# EAGLE design HQspd_board (EAGLE 9.6.2)
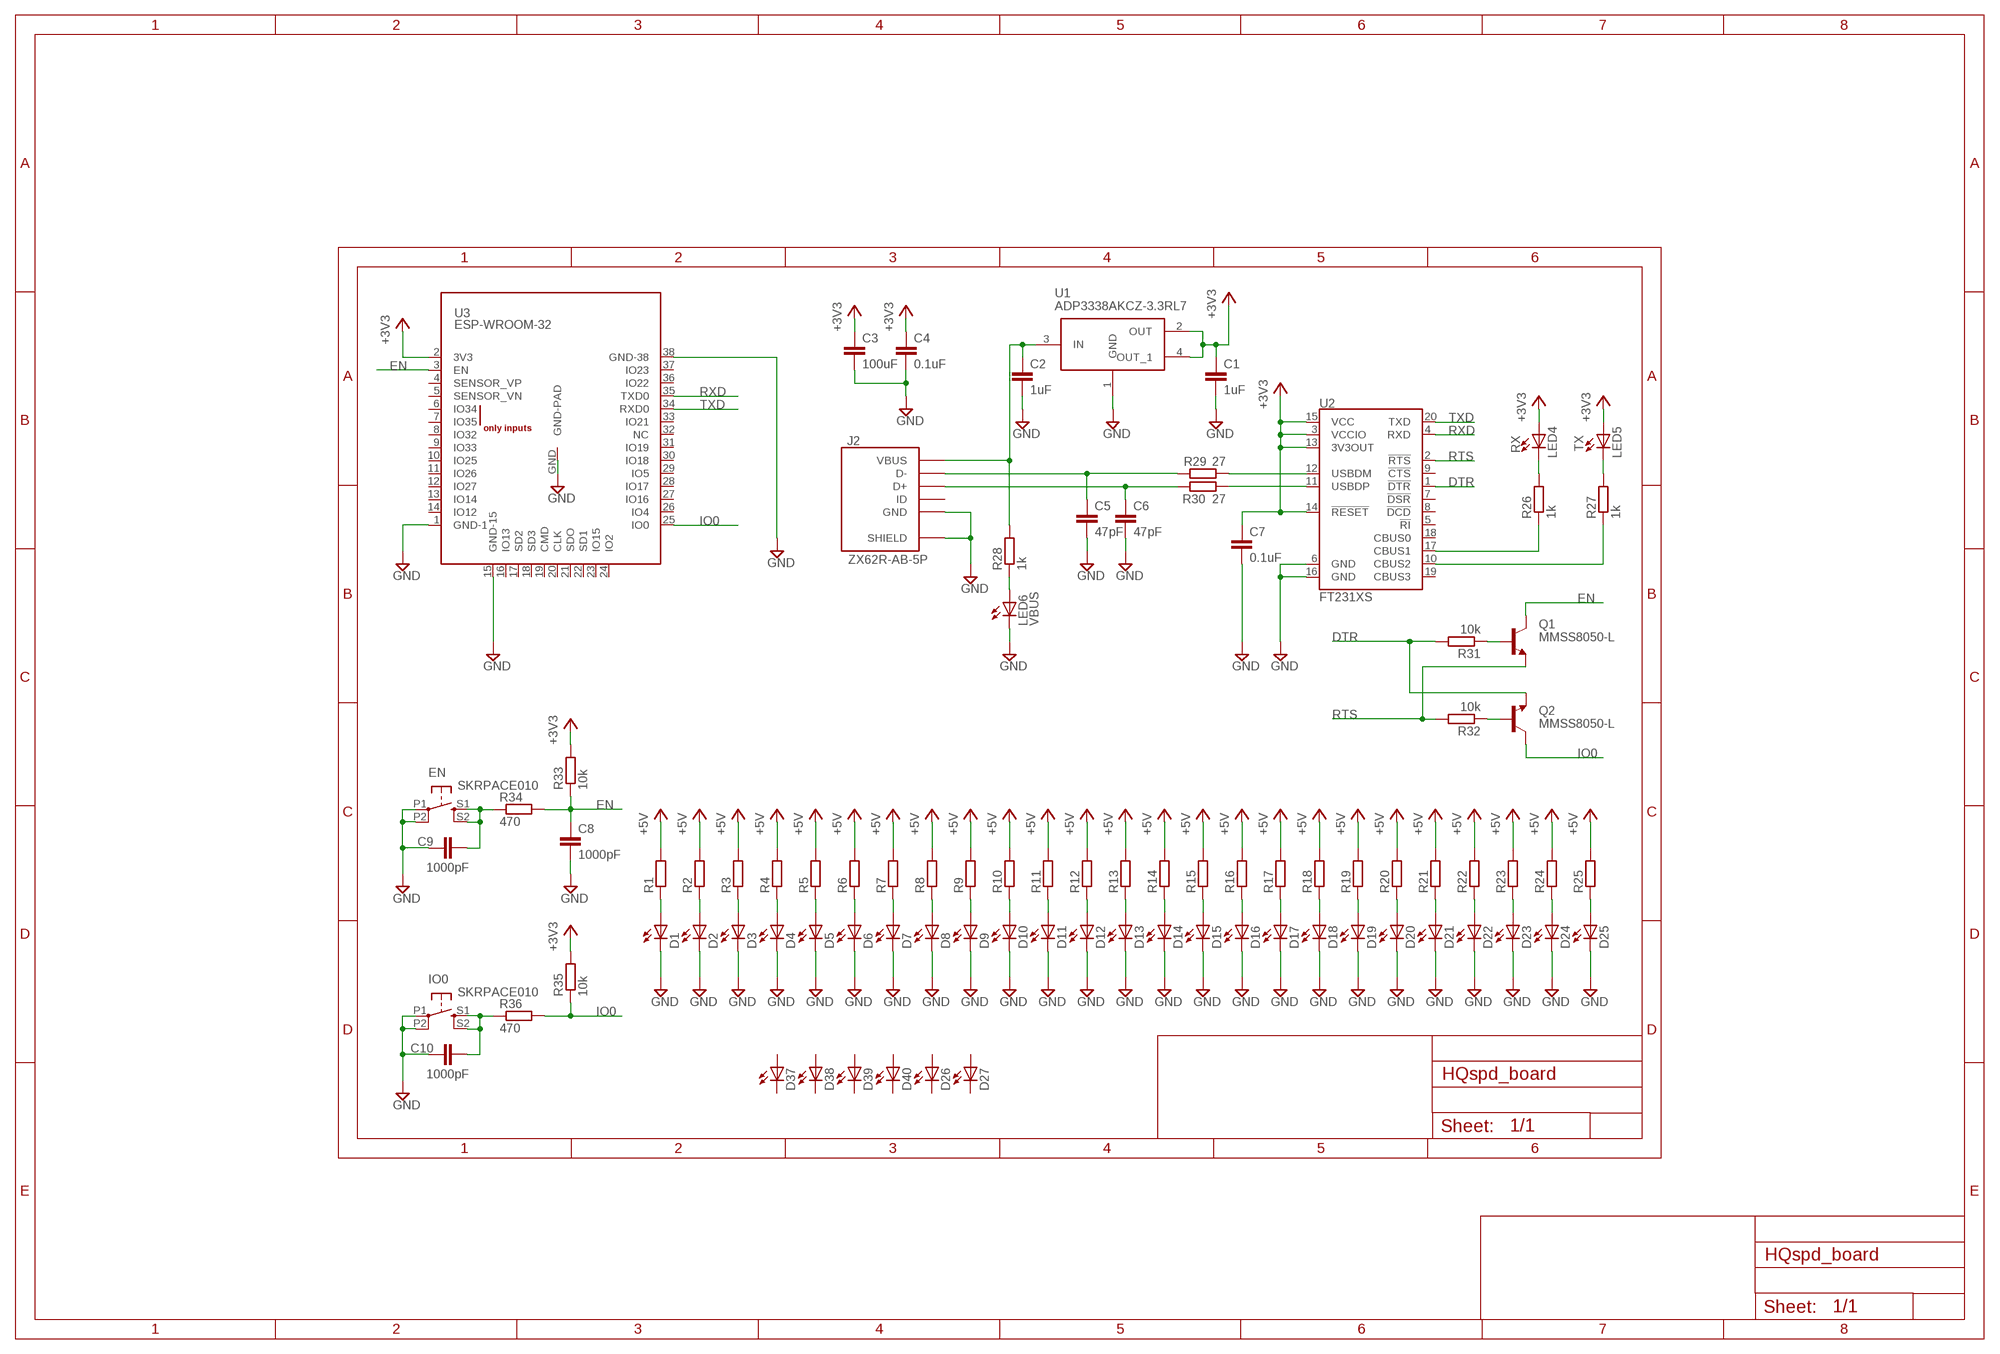
[diagram p0: schematic, sheet 1]

## Parts
C1  1uF  C-EUC0603  [C0603]
C2  1uF  C-EUC0603  [C0603]
C3  100uF  C-EUC1210  [C1210]
C4  0.1uF  C-EUC0603  [C0603]
C5  47pF  C-EUC0603  [C0603]
C6  47pF  C-EUC0603  [C0603]
C7  0.1uF  C-EUC0603  [C0603]
C8  1000pF  C-EUC0603  [C0603]
C9  1000pF  C-EUC0603  [C0603]
C10  1000pF  C-EUC0603  [C0603]
D1  LEDCHIPLED_0603  [CHIPLED_0603]
D2  LEDCHIPLED_0603  [CHIPLED_0603]
D3  LEDCHIPLED_0603  [CHIPLED_0603]
D4  LEDCHIPLED_0603  [CHIPLED_0603]
D5  LEDCHIPLED_0603  [CHIPLED_0603]
D6  LEDCHIPLED_0603  [CHIPLED_0603]
D7  LEDCHIPLED_0603  [CHIPLED_0603]
D8  LEDCHIPLED_0603  [CHIPLED_0603]
D9  LEDCHIPLED_0603  [CHIPLED_0603]
D10  LEDCHIPLED_0603  [CHIPLED_0603]
D11  LEDCHIPLED_0603  [CHIPLED_0603]
D12  LEDCHIPLED_0603  [CHIPLED_0603]
D13  LEDCHIPLED_0603  [CHIPLED_0603]
D14  LEDCHIPLED_0603  [CHIPLED_0603]
D15  LEDCHIPLED_0603  [CHIPLED_0603]
D16  LEDCHIPLED_0603  [CHIPLED_0603]
D17  LEDCHIPLED_0603  [CHIPLED_0603]
D18  LEDCHIPLED_0603  [CHIPLED_0603]
D19  LEDCHIPLED_0603  [CHIPLED_0603]
D20  LEDCHIPLED_0603  [CHIPLED_0603]
D21  LEDCHIPLED_0603  [CHIPLED_0603]
D22  LEDCHIPLED_0603  [CHIPLED_0603]
D23  LEDCHIPLED_0603  [CHIPLED_0603]
D24  LEDCHIPLED_0603  [CHIPLED_0603]
D25  LEDCHIPLED_0603  [CHIPLED_0603]
D26  LED3MM  [LED3MM]
D27  LED3MM  [LED3MM]
D37  LED3MM  [LED3MM]
D38  LED3MM  [LED3MM]
D39  LED3MM  [LED3MM]
D40  LED3MM  [LED3MM]
EN  SKRPACE010  [SKRPACE010]
IO0  SKRPACE010  [SKRPACE010]
J2  ZX62R-AB-5P  [ZX62R-B-5PA]
LED4  RX  LEDCHIPLED_0603  [CHIPLED_0603]
LED5  TX  LEDCHIPLED_0603  [CHIPLED_0603]
LED6  VBUS  LEDCHIPLED_0603  [CHIPLED_0603]
Q1  MMSS8050-L  [SOT23]
Q2  MMSS8050-L  [SOT23]
R1  R-EU_R0603  [R0603]
R2  R-EU_R0603  [R0603]
R3  R-EU_R0603  [R0603]
R4  R-EU_R0603  [R0603]
R5  R-EU_R0603  [R0603]
R6  R-EU_R0603  [R0603]
R7  R-EU_R0603  [R0603]
R8  R-EU_R0603  [R0603]
R9  R-EU_R0603  [R0603]
R10  R-EU_R0603  [R0603]
R11  R-EU_R0603  [R0603]
R12  R-EU_R0603  [R0603]
R13  R-EU_R0603  [R0603]
R14  R-EU_R0603  [R0603]
R15  R-EU_R0603  [R0603]
R16  R-EU_R0603  [R0603]
R17  R-EU_R0603  [R0603]
R18  R-EU_R0603  [R0603]
R19  R-EU_R0603  [R0603]
R20  R-EU_R0603  [R0603]
R21  R-EU_R0603  [R0603]
R22  R-EU_R0603  [R0603]
R23  R-EU_R0603  [R0603]
R24  R-EU_R0603  [R0603]
R25  R-EU_R0603  [R0603]
R26  1k  R-EU_R0603  [R0603]
R27  1k  R-EU_R0603  [R0603]
R28  1k  R-EU_R0603  [R0603]
R29  27  R-EU_R0603  [R0603]
R30  27  R-EU_R0603  [R0603]
R31  10k  R-EU_R0603  [R0603]
R32  10k  R-EU_R0603  [R0603]
R33  10k  R-EU_R0603  [R0603]
R34  470  R-EU_R0603  [R0603]
R35  10k  R-EU_R0603  [R0603]
R36  470  R-EU_R0603  [R0603]
U1  ADP3338AKCZ-3.3RL7  [SOT230P700X180-4N]
U2  FT231XS  [SSOP20_L]
U3  ESP-WROOM-32  [ESP-WROOM-32]

## Nets
+3V3: C1.1 C3.1 C4.1 C7.1 LED4.A LED5.A R33.2 R35.2 U1.2(OUT) U1.4(OUT_1) U2.3(VCCIO) U2.13(3V3OUT) U2.14(!RESET) U2.15(VCC) U3.2(3V3)
+5V: R1.2 R2.2 R3.2 R4.2 R5.2 R6.2 R7.2 R8.2 R9.2 R10.2 R11.2 R12.2 R13.2 R14.2 R15.2 R16.2 R17.2 R18.2 R19.2 R20.2 R21.2 R22.2 R23.2 R24.2 R25.2
+5V1: C2.1 J2.VCC(VBUS) R28.2 U1.3(IN)
D2_N1 [diffrencial pair]: R29.2 U2.12(USBDM)
D2_P1 [diffrencial pair]: R30.2 U2.11(USBDP)
D_N1 [diffrencial pair]: C5.1 J2.D- R29.1
D_P1 [diffrencial pair]: C6.1 J2.D+ R30.1
DTR: Q2.E R31.2 U2.1(!DTR)
EN: C8.1 Q1.C R33.1 R34.2 U3.3(EN)
GND: C1.2 C2.2 C3.2 C4.2 C5.2 C6.2 C7.2 C8.2 C9.1 C10.1 D1.C D2.C D3.C D4.C D5.C D6.C D7.C D8.C D9.C D10.C D11.C D12.C D13.C D14.C D15.C D16.C D17.C D18.C D19.C D20.C D21.C D22.C D23.C D24.C D25.C EN.P1(P) EN.P2(P1) IO0.P1(P) IO0.P2(P1) J2.GND J2.SHIELD@1(SHIELD) J2.SHIELD@2(SHIELD) J2.SHIELD@3(SHIELD) J2.SHIELD@4(SHIELD) LED6.C U1.1(GND) U2.6(GND) U2.16(GND) U3.1(GND-1) U3.15(GND-15) U3.38(GND-38) U3.GND(GND-PAD)
IO0: Q2.C R35.1 R36.2 U3.25(IO0)
N$1: D1.A R1.1
N$2: D11.A R11.1
N$3: D2.A R2.1
N$4: D3.A R3.1
N$5: D4.A R4.1
N$6: D5.A R5.1
N$7: D6.A R6.1
N$8: D7.A R7.1
N$9: D8.A R8.1
N$10: D9.A R9.1
N$11: D10.A R10.1
N$12: D12.A R12.1
N$13: D13.A R13.1
N$14: D14.A R14.1
N$15: D15.A R15.1
N$16: D16.A R16.1
N$17: D17.A R17.1
N$18: D18.A R18.1
N$19: D19.A R19.1
N$20: D20.A R20.1
N$21: D21.A R21.1
N$22: D22.A R22.1
N$23: D23.A R23.1
N$24: D24.A R24.1
N$25: D25.A R25.1
N$26: LED4.C R26.2
N$27: LED5.C R27.2
N$128: C9.2 EN.S1(S) EN.S2(S1) R34.1
N$129: C10.2 IO0.S1(S) IO0.S2(S1) R36.1
N$130: R26.1 U2.17(CBUS1)
N$131: R27.1 U2.10(CBUS2)
N$134: LED6.A R28.1
N$136: Q1.B R31.1
N$137: Q2.B R32.1
RTS: Q1.E R32.2 U2.2(!RTS)
RXD: U2.4(RXD) U3.35(TXD0)
TXD: U2.20(TXD) U3.34(RXD0)
Unconnected: D26.A D26.K(C) D27.A D27.K(C) D37.A D37.K(C) D38.A D38.K(C) D39.A D39.K(C) D40.A D40.K(C) J2.ID U2.5(!RI) U2.7(!DSR) U2.8(!DCD) U2.9(!CTS) U2.18(CBUS0) U2.19(CBUS3) U3.4(SENSOR_VP) U3.5(SENSOR_VN) U3.6(IO34) U3.7(IO35) U3.8(IO32) U3.9(IO33) U3.10(IO25) U3.11(IO26) U3.12(IO27) U3.13(IO14) U3.14(IO12) U3.16(IO13) U3.17(SD2) U3.18(SD3) U3.19(CMD) U3.20(CLK) U3.21(SDO) U3.22(SD1) U3.23(IO15) U3.24(IO2) U3.26(IO4) U3.27(IO16) U3.28(IO17) U3.29(IO5) U3.30(IO18) U3.31(IO19) U3.32(NC) U3.33(IO21) U3.36(IO22) U3.37(IO23)

## Library data of the parts
C1-C10 = taki-library:C-EU: CAPACITOR, European symbol
D1-D27 D37-D40 LED4-LED6 = taki-library:LED: LED OSRAM: - CHIPLED LG R971, LG N971, LY N971, LG Q971, LY Q971, LO R971, LY R971 LH N974, LH R974 LS Q976, LO Q976, LY Q976 LO Q996 - Hyper CHIPLED LW Q18S LB Q993, LB Q99A, LB R99A - SideLED LS A670, LO A670, LY A670, LG A670, LP A670 LB A673, LV A673, LT A673, LW A673 LH A674 LY A675 LS A676, LA A676, LO A676, LY A676, LW A676 LS A679, LY A679, LG A679 - Hyper Micro SIDELED® LS Y876, LA Y876, LO Y876, LY Y876 LT Y87S - SmartLED LW L88C, LW L88S LB L89C, LB L89S, LG L890 LS L89K, LO L89K, LY L89K LS L896, LA L896, LO L896, LY L896 - TOPLED LS T670, LO T670, LY T670, LG T670, LP T670 LSG T670, LSP T670, LSY T670, LOP T670, LYG T670 LG T671, LOG T671, LSG T671 LB T673, LV T673, LT T673, LW T673 LH T674 LS T676, LA T676, LO T676, LY T676, LB T676, LH T676, LSB T676, LW T676 LB T67C, LV T67C, LT T67C, LS T67K, LO T67K, LY T67K, LW E67C LS E67B, LA E67B, LO E67B, LY E67B, LB E67C, LV E67C, LT E67C LW T67C LS T679, LY T679, LG T679 LS T770, LO T770, LY T770, LG T770, LP T770 LB T773, LV T773, LT T773, LW T773 LH T774 LS E675, LA E675, LY E675, LS T675 LS T776, LA T776, LO T776, LY T776, LB T776 LHGB T686 LT T68C, LB T68C - Hyper Mini TOPLED® LB M676 - Mini TOPLED Santana® LG M470 LS M47K, LO M47K, LY M47K Source: http://www.osram.convergy.de LUXEON: - LUMILED® LXK2-PW12-R00, LXK2-PW12-S00, LXK2-PW14-U00, LXK2-PW14-V00 LXK2-PM12-R00, LXK2-PM12-S00, LXK2-PM14-U00 LXK2-PE12-Q00, LXK2-PE12-R00, LXK2-PE12-S00, LXK2-PE14-T00, LXK2-PE14-U00 LXK2-PB12-K00, LXK2-PB12-L00, LXK2-PB12-M00, LXK2-PB14-N00, LXK2-PB14-P00, LXK2-PB14-Q00 LXK2-PR12-L00, LXK2-PR12-M00, LXK2-PR14-Q00, LXK2-PR14-R00 LXK2-PD12-Q00, LXK2-PD12-R00, LXK2-PD12-S00 LXK2-PH12-R00, LXK2-PH12-S00 LXK2-PL12-P00, LXK2-PL12-Q00, LXK2-PL12-R00 Source: www.luxeon.com KINGBRIGHT: KA-3528ASYC Source: www.kingbright.com
EN IO0 = taki-library:SKRPACE010
J2 = taki-library:ZX62
Q1 Q2 = taki-library:MMSS8050: Bipolar (BJT) Transistor NPN 25V 1.5A 100MHz 625mW Surface Mount SOT-23; DIGIKEY_URL: https://www.digikey.jp/product-detail/ja/micro-commercial-co/MMSS8050-L-TP/MMSS8050-L-TPMSCT-ND/2827203; MARUTSU_URL: https://www.marutsu.co.jp/pc/i/15861860/; STORE: MARUTSU; URL: https://www.marutsu.co.jp/pc/i/15861860/
R1-R36 = taki-library:R-EU_: RESISTOR, European symbol
U1 = library:ADP3338AKCZ-3.3RL7: LDO Regulator 3.3V 1.6A Analog Devices ADP3338AKCZ-3.3RL7, LDO Voltage Regulator, 1.6A, 3.3 V 0.8%, 2.7 8 Vin, 4-Pin SOT-223 Source: Datasheet <http://uk.rs-online.com/web/p/products/9126350>; DESCRIPTION: LDO Regulator 3.3V 1.6A Analog Devices ADP3338AKCZ-3.3RL7, LDO Voltage Regulator, 1.6A, 3.3 V 0.8%, 2.7 8 Vin, 4-Pin SOT-223; HEIGHT: 1.8mm; MANUFACTURER_NAME: Analog Devices; MANUFACTURER_PART_NUMBER: ADP3338AKCZ-3.3RL7; RS_PART_NUMBER: 9126350
U2 = taki-library:FT231X: FTDI FT231X Full Speed USB to Full-handshake UART This USB2.0 Full Speed IC offers a compact bridge to full handshake UART interfaces. The device is a UART, capable of operating up to 3MBaud, with low power consumption (8mA). The FT231X includes the complete FT-X series feature set and enables USB to be added into a system design quickly and easily over a UART interface. Datasheet <http://cdn.sparkfun.com/datasheets/Components/General%20IC/DS_FT231X.pdf> SparkFun Products SparkFun RedBoard - Programmed with Arduino <https://www.sparkfun.com/products/12757> (DEV-12757) SparkFun XBee Explorer USB <https://www.sparkfun.com/products/11812> (WRL-11812) SparkFun XBee Explorer Dongle <https://www.sparkfun.com/products/11697> (WRL-11697) SparkFun Blynk Board - ESP8266 <https://www.sparkfun.com/products/13794> (WRL-13794) SparkFun ESP8266 Thing - Dev Board <https://www.sparkfun.com/products/13711> (WRL-13711) SparkFun Block for Intel® Edison - Base <https://www.sparkfun.com/products/13045> (DEV-13045) SparkFun RedStick <https://www.sparkfun.com/products/13741> (DEV-13741) SparkFun Beefy 3 - FTDI Basic Breakout <https://www.sparkfun.com/products/13746> (DEV-13746) SparkFun FT231X Breakout <https://www.sparkfun.com/products/11736> (BOB-11736); PROD_ID: IC-11524
U3 = taki-library:ESP-WROOM-32

## Net classes
2 diffrencial pair: width 0.15 mm, clearance 0.3 mm to class 0, clearance 0.3 mm to class 1, clearance 0.15 mm

## Board
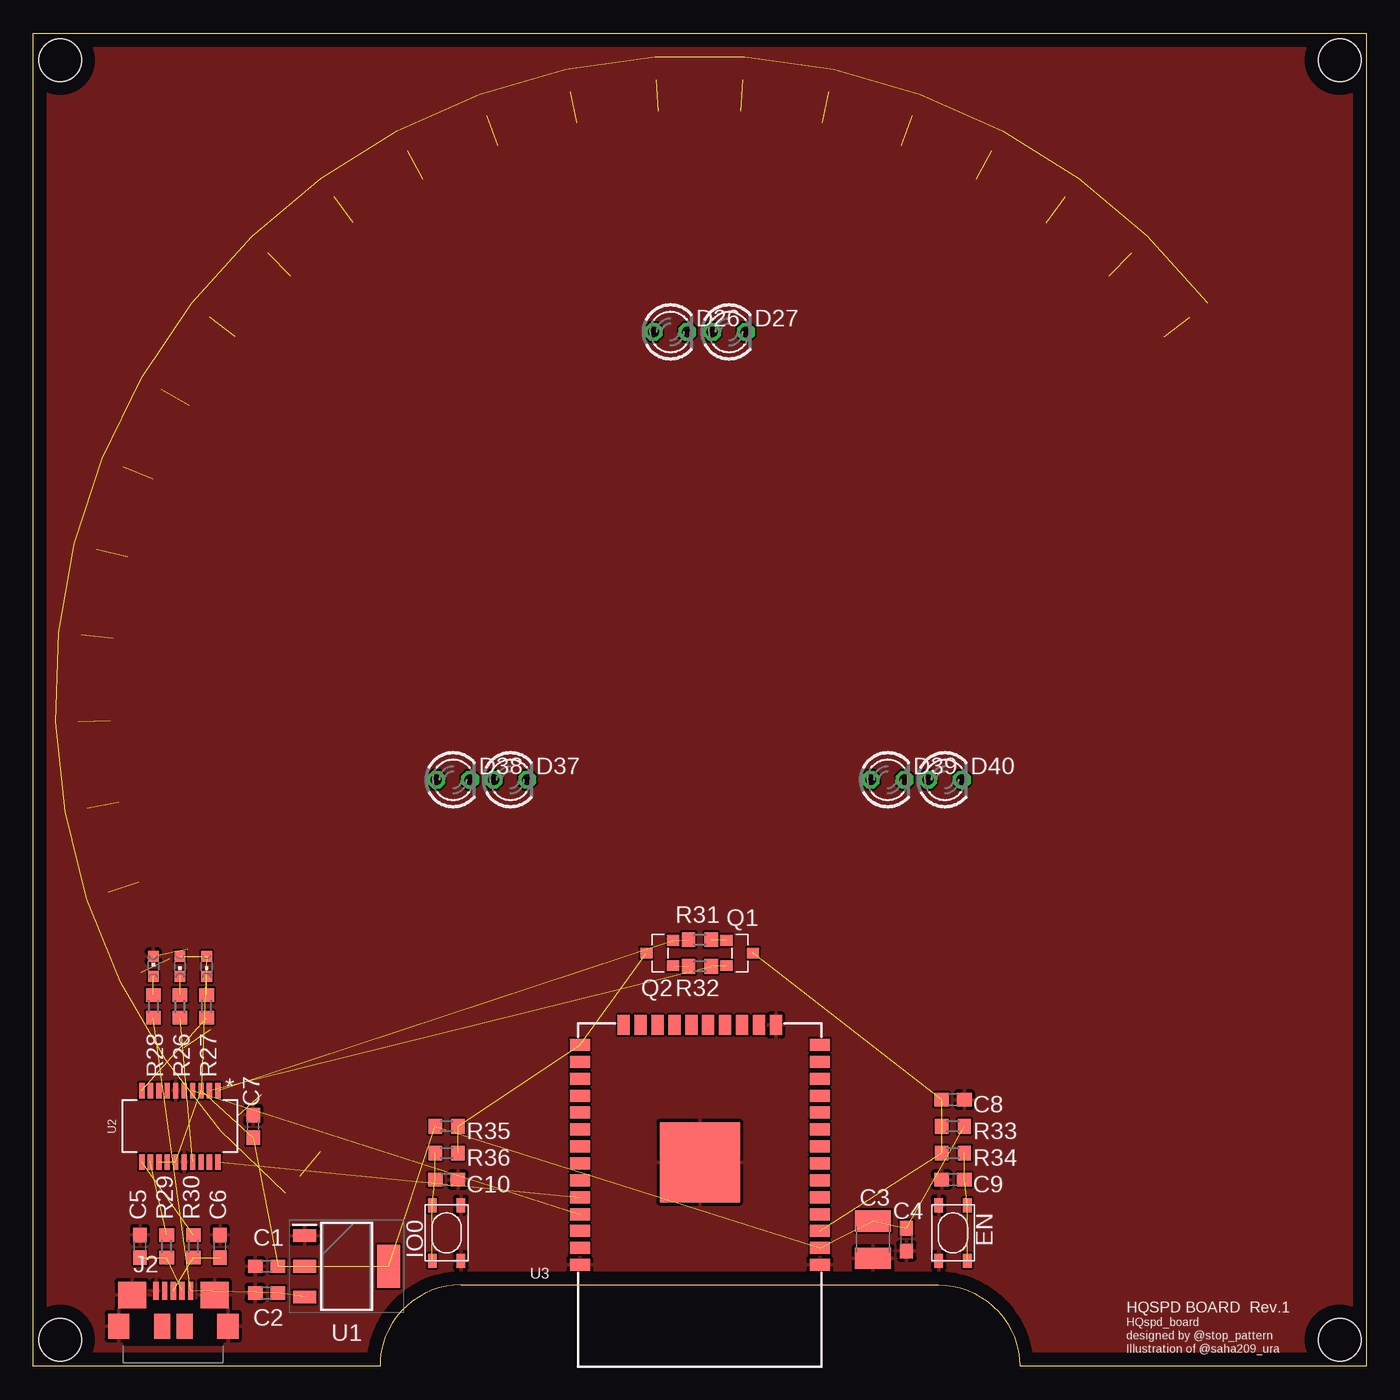
[diagram p1: board, top side]
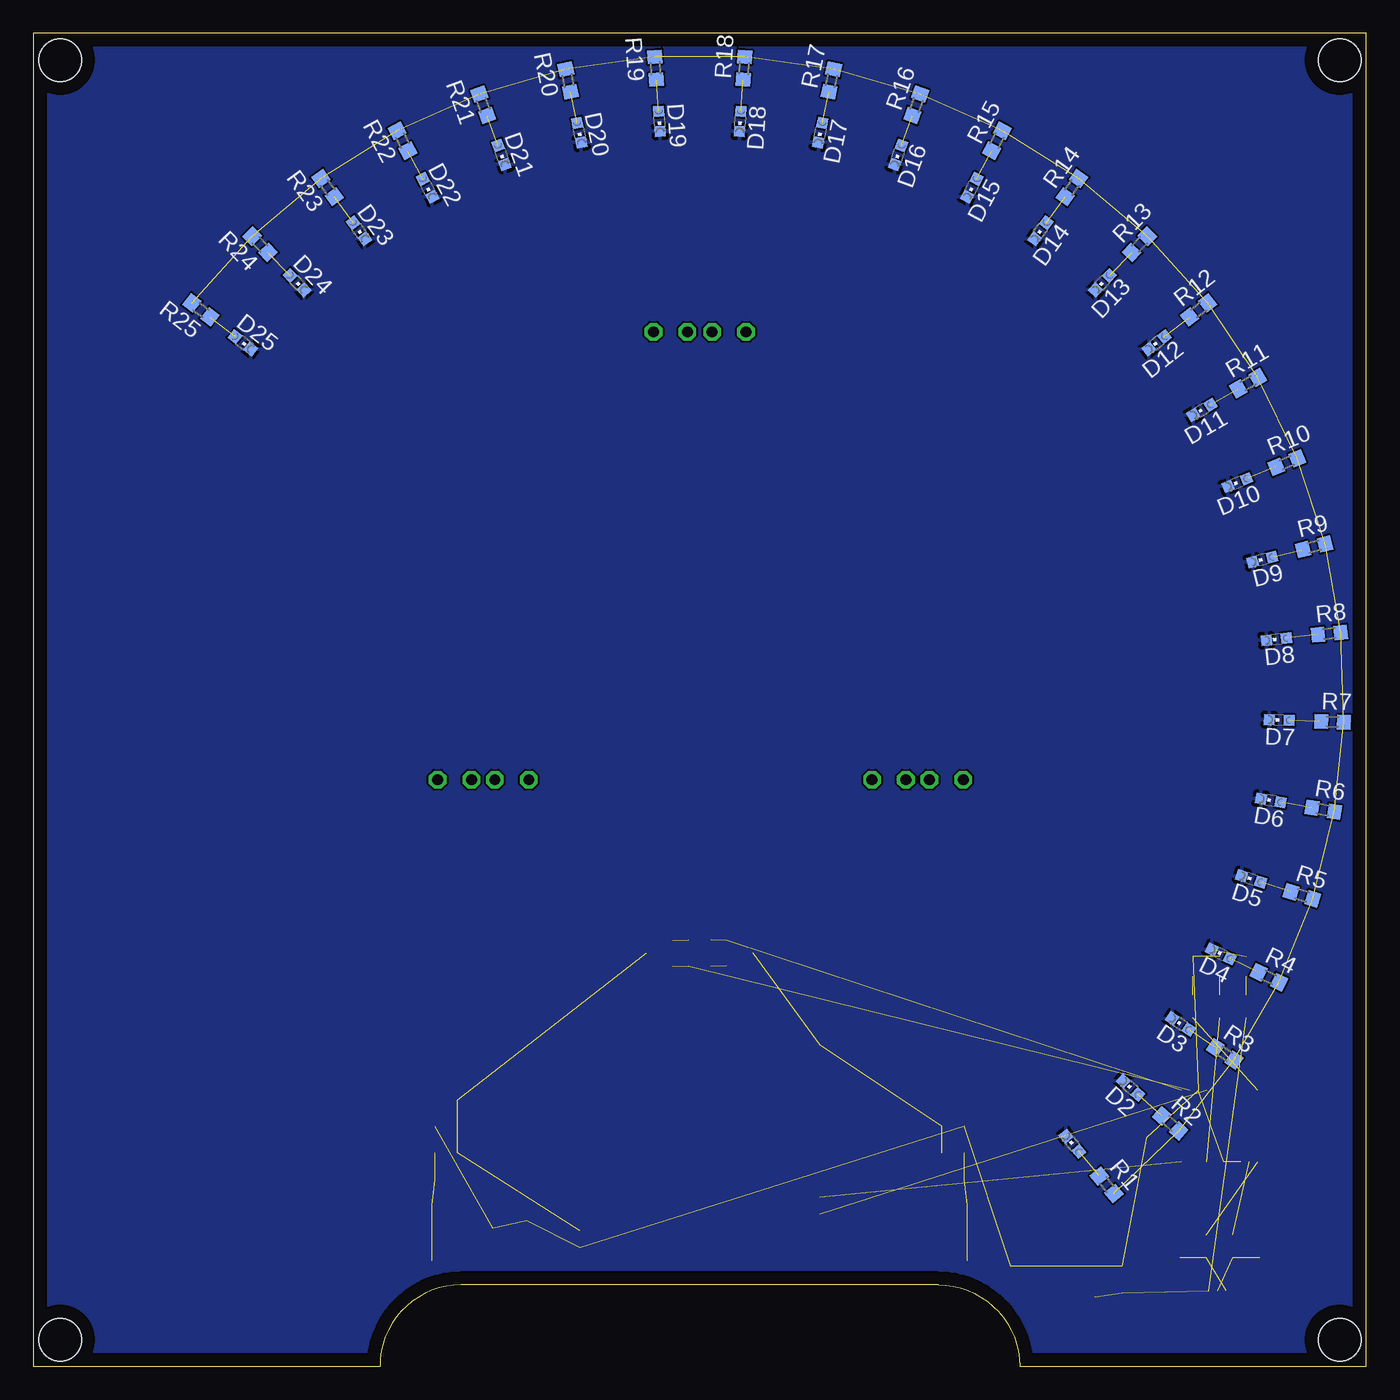
[diagram p2: board, bottom side, seen from below]

Size 100 x 100 mm. Coordinates in mm from the lower left corner, seen from the top.
Outline: 0,0 0,100 100,100 100,0 74,0 arc90 67.9,6.1 32.1,6.1 arc90 26,0 0,0
Copper layers (1*16): Top 0.035mm / dielectric 0.15mm / Bottom 0.035mm
Design rules "default": minimum track width 6mil, minimum drill 0.35mm, track to track 6mil, track to pad 6mil, pad to pad 6mil, via to via 6mil, smd to smd 6mil, copper to edge 40mil, drill to drill 6mil, minimum pad ring 10mil, minimum via ring 8mil, stop-mask expansion 4mil, vias tented up to drill 0mil, thermal gap 10mil
Holes 3.2 mm at 98,98 98,2 2,2 2,98
tKeepout: area 96,96 to 100,100; area 96,0 to 100,4; area 0,0 to 4,4; area 0,96 to 4,100
bKeepout: area 96,96 to 100,100; area 96,0 to 100,4; area 0,0 to 4,4; area 0,96 to 4,100

### Footprints (pad centres in the part's own frame; a part is rotated, then mirrored left to right if it is on the bottom)
C0603 = smd 1.1 x 1: 1 -0.85,0; 2 0.85,0
C1210 = smd 1.6 x 2.7: 1 -1.4,0; 2 1.4,0
CHIPLED_0603 = smd 0.8 x 0.8: A 0,-0.75; C 0,0.75
LED3MM = drill 0.813 octagon: A -1.27,0; K 1.27,0
SKRPACE010 = smd 1.05 x 0.65: P1 -2.075,-1.075; P2 2.075,-1.075; S1 -2.075,1.075; S2 2.075,1.075
ZX62R-B-5PA = smd 0.4 x 1.35: D+ 0,2.675; D- 0.65,2.675; GND -1.3,2.675; ID -0.65,2.675; VCC 1.3,2.675 | smd 1.2 x 1.9: NC@1 -0.85,0; NC@2 0.85,0 | smd 2.1 x 2: SHIELD@1 -3.1,2.35; SHIELD@2 3.1,2.35 | smd 1.6 x 1.9: SHIELD@3 -4.1,0; SHIELD@4 4.1,0
SOT23 = smd 0.8 x 0.9: B -0.95,-1; C 0,1; E 0.95,-1
R0603 = smd 1 x 1.1: 1 -0.85,0; 2 0.85,0
SOT230P700X180-4N = smd 1.75 x 0.95: 1 -3.15,2.3; 2 -3.15,0; 3 -3.15,-2.3 | smd 1.75 x 3.2: 4 3.15,0
SSOP20_L = smd 0.4 x 1.143: 1 -2.857,-2.68; 2 -2.223,-2.68; 3 -1.587,-2.68; 4 -0.953,-2.68; 5 -0.318,-2.68; 6 0.318,-2.68; 7 0.953,-2.68; 8 1.587,-2.68; 9 2.223,-2.68; 10 2.857,-2.68; 11 2.857,2.68; 12 2.223,2.68; 13 1.587,2.68; 14 0.953,2.68; 15 0.318,2.68; 16 -0.318,2.68; 17 -0.953,2.68; 18 -1.587,2.68; 19 -2.223,2.68; 20 -2.857,2.68
ESP-WROOM-32 = smd 0.9 x 1.5: 1 7.7,9; 2 6.43,9; 3 5.16,9; 4 3.89,9; 5 2.62,9; 6 1.35,9; 7 0.08,9; 8 -1.19,9; 9 -2.46,9; 10 -3.73,9; 11 -5,9; 12 -6.27,9; 13 -7.54,9; 14 -8.81,9; 25 -8.81,-9; 26 -7.54,-9; 27 -6.27,-9; 28 -5,-9; 29 -3.73,-9; 30 -2.46,-9; 31 -1.19,-9; 32 0.08,-9; 33 1.35,-9; 34 2.62,-9; 35 3.89,-9; 36 5.16,-9; 37 6.43,-9; 38 7.7,-9 | smd 1.5 x 0.9: 15 -10.3,5.715; 16 -10.3,4.445; 17 -10.3,3.175; 18 -10.3,1.905; 19 -10.3,0.635; 20 -10.3,-0.635; 21 -10.3,-1.905; 22 -10.3,-3.175; 23 -10.3,-4.445; 24 -10.3,-5.715 | smd 6 x 6: GND 0,0

### Placement (x,y rotation side)
C1  17.5,7.5 180 top
C2  17.5,5.5 180 top
C3  63,9.5 270 top
C4  65.5,9.5 270 top
C5  8,9 90 top
C6  14,9 90 top
C7  16.5,18 90 top
C8  69,20 0 top
C9  69,14 0 top
C10  31,14 180 top
D1  22.04,16.68 40 bottom
D2  17.67,20.89 48 bottom
D3  13.94,25.68 56 bottom
D4  10.9,30.93 64 bottom
D5  8.63,36.56 72 bottom
D6  7.16,42.45 80 bottom
D7  6.53,48.48 88 bottom
D8  6.74,54.55 96 bottom
D9  7.79,60.52 104 bottom
D10  9.67,66.3 112 bottom
D11  12.33,71.75 120 bottom
D12  15.72,76.78 128 bottom
D13  19.78,81.29 136 bottom
D14  24.43,85.19 144 bottom
D15  29.58,88.41 152 bottom
D16  35.12,90.88 160 bottom
D17  40.96,92.55 168 bottom
D18  46.97,93.39 176 bottom
D19  53.03,93.39 184 bottom
D20  59.04,92.55 192 bottom
D21  64.88,90.88 200 bottom
D22  70.42,88.41 208 bottom
D23  75.57,85.19 216 bottom
D24  80.22,81.29 224 bottom
D25  84.28,76.78 232 bottom
D26  47.8,77.6 0 top
D27  52.2,77.6 0 top
D37  35.8,44 0 top
D38  31.5,44 0 top
D39  64.1,44 0 top
D40  68.4,44 0 top
EN  69,10 270 top
IO0  31,10 90 top
J2  10.5,3 0 top
LED4  11,30 180 top
LED5  13,30 180 top
LED6  9,30 0 top
Q1  53,31 270 top
Q2  47,31 90 top
R1  19.47,13.61 310 bottom
R2  14.7,18.22 318 bottom
R3  10.62,23.44 326 bottom
R4  7.31,29.18 334 bottom
R5  4.82,35.32 342 bottom
R6  3.22,41.75 350 bottom
R7  2.53,48.34 358 bottom
R8  2.76,54.97 6 bottom
R9  3.91,61.49 14 bottom
R10  5.96,67.79 22 bottom
R11  8.86,73.75 30 bottom
R12  12.57,79.24 38 bottom
R13  17,84.17 46 bottom
R14  22.08,88.43 54 bottom
R15  27.7,91.94 62 bottom
R16  33.75,94.64 70 bottom
R17  40.12,96.46 78 bottom
R18  46.69,97.38 86 bottom
R19  53.31,97.38 94 bottom
R20  59.88,96.46 102 bottom
R21  66.25,94.64 110 bottom
R22  72.3,91.94 118 bottom
R23  77.92,88.43 126 bottom
R24  83,84.17 134 bottom
R25  87.43,79.24 142 bottom
R26  11,27 90 top
R27  13,27 90 top
R28  9,27 270 top
R29  10,9 90 top
R30  12,9 90 top
R31  50,32 180 top
R32  50,30 0 top
R33  69,18 0 top
R34  69,16 180 top
R35  31,18 180 top
R36  31,16 0 top
U1  23.5,7.5 0 top
U2  11,18 180 top
U3  50,15.3 270 top

### Tracks (layer width: path | path; a pad name or v marks a point on that pad's centre or on a via)
+3V3  (14 unrouted)
+5V  (24 unrouted)
+5V1  (3 unrouted)
D2_N1  (1 unrouted)
D2_P1  (1 unrouted)
D_N1  (2 unrouted)
D_P1  (2 unrouted)
DTR  (2 unrouted)
EN  (4 unrouted)
GND  (1 unrouted)
  pour Bottom: 0,110 0,0 100,0 100,110
  pour Top: 110,100 0,100 0,0 110,0
IO0  (3 unrouted)
N$1  (1 unrouted)
N$2  (1 unrouted)
N$3  (1 unrouted)
N$4  (1 unrouted)
N$5  (1 unrouted)
N$6  (1 unrouted)
N$7  (1 unrouted)
N$8  (1 unrouted)
N$9  (1 unrouted)
N$10  (1 unrouted)
N$11  (1 unrouted)
N$12  (1 unrouted)
N$13  (1 unrouted)
N$14  (1 unrouted)
N$15  (1 unrouted)
N$16  (1 unrouted)
N$17  (1 unrouted)
N$18  (1 unrouted)
N$19  (1 unrouted)
N$20  (1 unrouted)
N$21  (1 unrouted)
N$22  (1 unrouted)
N$23  (1 unrouted)
N$24  (1 unrouted)
N$25  (1 unrouted)
N$26  (1 unrouted)
N$27  (1 unrouted)
N$128  (3 unrouted)
N$129  (3 unrouted)
N$130  (1 unrouted)
N$131  (1 unrouted)
N$134  (1 unrouted)
N$136  (1 unrouted)
N$137  (1 unrouted)
RTS  (2 unrouted)
RXD  (1 unrouted)
TXD  (1 unrouted)

### Text on the board
tPlace: HQSPD BOARD Rev.1 | designed by @stop_pattern | Illustration of @saha209_ura
201bmp: D:/users/okdwt/Downloads/spd_design3.bmp